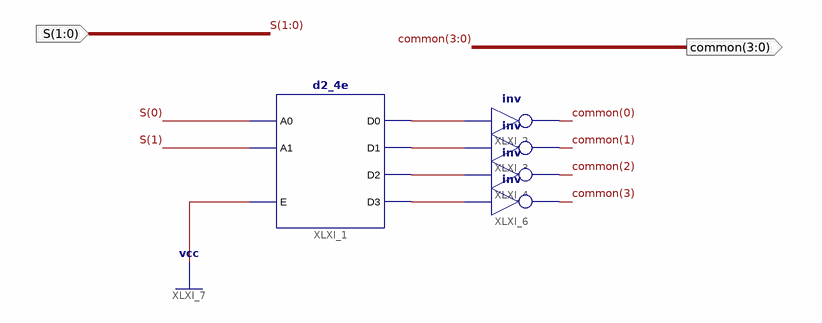
[diagram p0: schematic sheet 1]
// Xilinx ISE schematic COMMONS_SELECTOR.sch (spartan6) as structural Verilog: 5 symbols, 2 ports
module COMMONS_SELECTOR (
  input  [1:0] S,
  output [3:0] common
);

  wire XLXN_4, XLXN_5, XLXN_6, XLXN_7;

  d2_4e XLXI_1 (.A0(S[0]), .A1(S[1]), .E(1'b1), .D0(XLXN_4), .D1(XLXN_5), .D2(XLXN_6), .D3(XLXN_7));
  not XLXI_2 (common[0], XLXN_4);
  not XLXI_3 (common[1], XLXN_5);
  not XLXI_4 (common[2], XLXN_6);
  not XLXI_6 (common[3], XLXN_7);
endmodule
